# EAGLE design ecube EIB HS64 2xOmnetics r1 0.30mm (EAGLE 7.4.0)
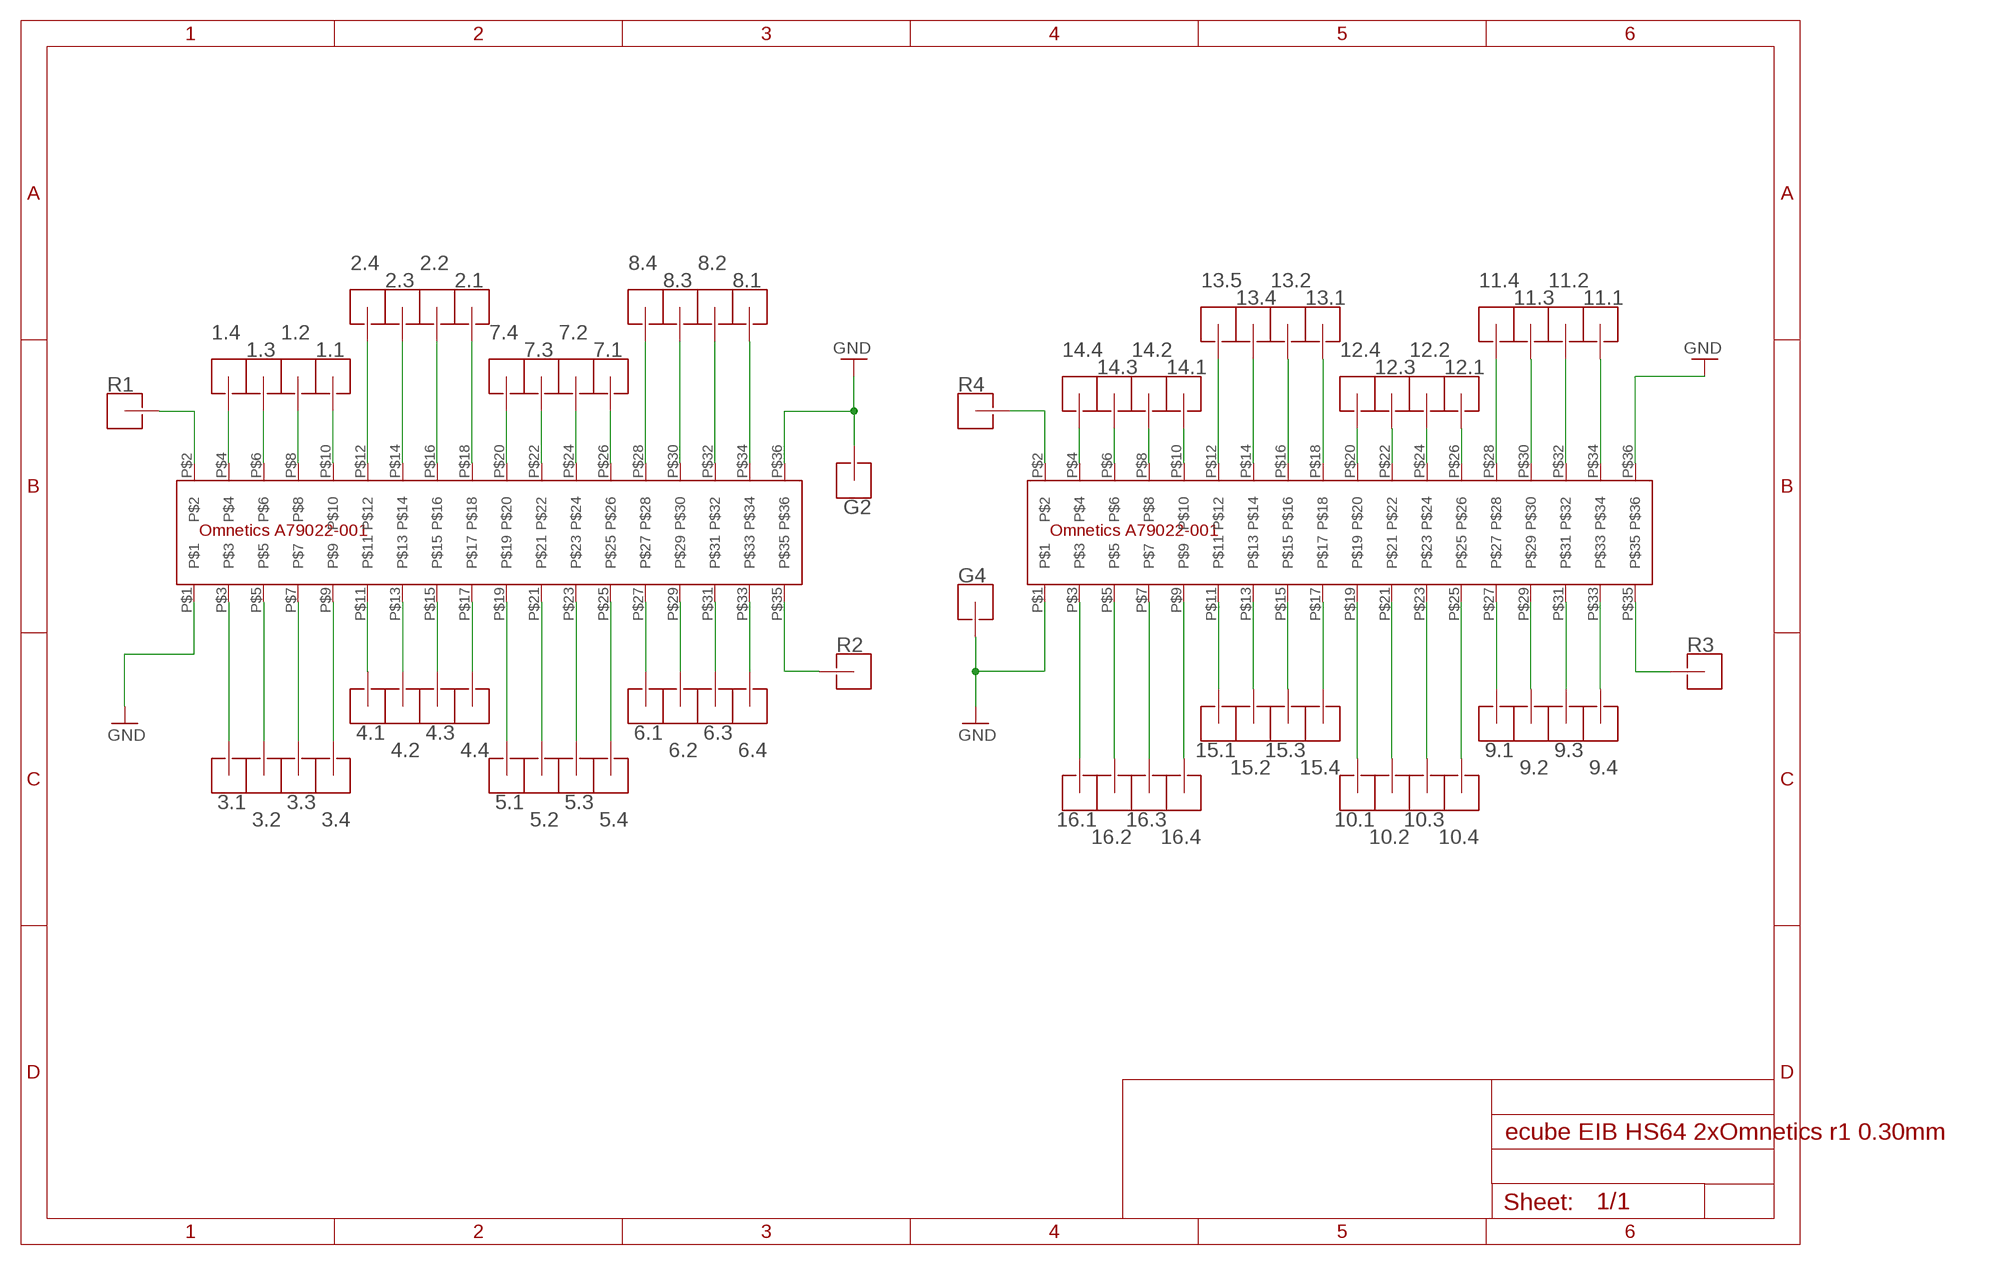
[diagram p0: schematic, sheet 1]

## Parts
1.1  HOLE_S_G_PIN_V3  [SMALL_GOLD_PIN_V3]
1.2  HOLE_S_G_PIN_V3  [SMALL_GOLD_PIN_V3]
1.3  HOLE_S_G_PIN_V3  [SMALL_GOLD_PIN_V3]
1.4  HOLE_S_G_PIN_V3  [SMALL_GOLD_PIN_V3]
2.1  HOLE_S_G_PIN_V3  [SMALL_GOLD_PIN_V3]
2.2  HOLE_S_G_PIN_V3  [SMALL_GOLD_PIN_V3]
2.3  HOLE_S_G_PIN_V3  [SMALL_GOLD_PIN_V3]
2.4  HOLE_S_G_PIN_V3  [SMALL_GOLD_PIN_V3]
3.1  HOLE_S_G_PIN_V3  [SMALL_GOLD_PIN_V3]
3.2  HOLE_S_G_PIN_V3  [SMALL_GOLD_PIN_V3]
3.3  HOLE_S_G_PIN_V3  [SMALL_GOLD_PIN_V3]
3.4  HOLE_S_G_PIN_V3  [SMALL_GOLD_PIN_V3]
4.1  HOLE_S_G_PIN_V3  [SMALL_GOLD_PIN_V3]
4.2  HOLE_S_G_PIN_V3  [SMALL_GOLD_PIN_V3]
4.3  HOLE_S_G_PIN_V3  [SMALL_GOLD_PIN_V3]
4.4  HOLE_S_G_PIN_V3  [SMALL_GOLD_PIN_V3]
5.1  HOLE_S_G_PIN_V3  [SMALL_GOLD_PIN_V3]
5.2  HOLE_S_G_PIN_V3  [SMALL_GOLD_PIN_V3]
5.3  HOLE_S_G_PIN_V3  [SMALL_GOLD_PIN_V3]
5.4  HOLE_S_G_PIN_V3  [SMALL_GOLD_PIN_V3]
6.1  HOLE_S_G_PIN_V3  [SMALL_GOLD_PIN_V3]
6.2  HOLE_S_G_PIN_V3  [SMALL_GOLD_PIN_V3]
6.3  HOLE_S_G_PIN_V3  [SMALL_GOLD_PIN_V3]
6.4  HOLE_S_G_PIN_V3  [SMALL_GOLD_PIN_V3]
7.1  HOLE_S_G_PIN_V3  [SMALL_GOLD_PIN_V3]
7.2  HOLE_S_G_PIN_V3  [SMALL_GOLD_PIN_V3]
7.3  HOLE_S_G_PIN_V3  [SMALL_GOLD_PIN_V3]
7.4  HOLE_S_G_PIN_V3  [SMALL_GOLD_PIN_V3]
8.1  HOLE_S_G_PIN_V3  [SMALL_GOLD_PIN_V3]
8.2  HOLE_S_G_PIN_V3  [SMALL_GOLD_PIN_V3]
8.3  HOLE_S_G_PIN_V3  [SMALL_GOLD_PIN_V3]
8.4  HOLE_S_G_PIN_V3  [SMALL_GOLD_PIN_V3]
9.1  HOLE_S_G_PIN_V3  [SMALL_GOLD_PIN_V3]
9.2  HOLE_S_G_PIN_V3  [SMALL_GOLD_PIN_V3]
9.3  HOLE_S_G_PIN_V3  [SMALL_GOLD_PIN_V3]
9.4  HOLE_S_G_PIN_V3  [SMALL_GOLD_PIN_V3]
10.1  HOLE_S_G_PIN_V3  [SMALL_GOLD_PIN_V3]
10.2  HOLE_S_G_PIN_V3  [SMALL_GOLD_PIN_V3]
10.3  HOLE_S_G_PIN_V3  [SMALL_GOLD_PIN_V3]
10.4  HOLE_S_G_PIN_V3  [SMALL_GOLD_PIN_V3]
11.1  HOLE_S_G_PIN_V3  [SMALL_GOLD_PIN_V3]
11.2  HOLE_S_G_PIN_V3  [SMALL_GOLD_PIN_V3]
11.3  HOLE_S_G_PIN_V3  [SMALL_GOLD_PIN_V3]
11.4  HOLE_S_G_PIN_V3  [SMALL_GOLD_PIN_V3]
12.1  HOLE_S_G_PIN_V3  [SMALL_GOLD_PIN_V3]
12.2  HOLE_S_G_PIN_V3  [SMALL_GOLD_PIN_V3]
12.3  HOLE_S_G_PIN_V3  [SMALL_GOLD_PIN_V3]
12.4  HOLE_S_G_PIN_V3  [SMALL_GOLD_PIN_V3]
13.1  HOLE_S_G_PIN_V3  [SMALL_GOLD_PIN_V3]
13.2  HOLE_S_G_PIN_V3  [SMALL_GOLD_PIN_V3]
13.4  HOLE_S_G_PIN_V3  [SMALL_GOLD_PIN_V3]
13.5  HOLE_S_G_PIN_V3  [SMALL_GOLD_PIN_V3]
14.1  HOLE_S_G_PIN_V3  [SMALL_GOLD_PIN_V3]
14.2  HOLE_S_G_PIN_V3  [SMALL_GOLD_PIN_V3]
14.3  HOLE_S_G_PIN_V3  [SMALL_GOLD_PIN_V3]
14.4  HOLE_S_G_PIN_V3  [SMALL_GOLD_PIN_V3]
15.1  HOLE_S_G_PIN_V3  [SMALL_GOLD_PIN_V3]
15.2  HOLE_S_G_PIN_V3  [SMALL_GOLD_PIN_V3]
15.3  HOLE_S_G_PIN_V3  [SMALL_GOLD_PIN_V3]
15.4  HOLE_S_G_PIN_V3  [SMALL_GOLD_PIN_V3]
16.1  HOLE_S_G_PIN_V3  [SMALL_GOLD_PIN_V3]
16.2  HOLE_S_G_PIN_V3  [SMALL_GOLD_PIN_V3]
16.3  HOLE_S_G_PIN_V3  [SMALL_GOLD_PIN_V3]
16.4  HOLE_S_G_PIN_V3  [SMALL_GOLD_PIN_V3]
G2  HOLE_L_G_PIN_V1  [LARGE_GOLD_PIN_V1]
G4  HOLE_L_G_PIN_V1  [LARGE_GOLD_PIN_V1]
R1  HOLE_L_G_PIN_V1  [LARGE_GOLD_PIN_V1]
R2  HOLE_L_G_PIN_V1  [LARGE_GOLD_PIN_V1]
R3  HOLE_L_G_PIN_V1  [LARGE_GOLD_PIN_V1]
R4  HOLE_L_G_PIN_V1  [LARGE_GOLD_PIN_V1]
U$1  A79022-001  [A79022-001]
U$2  A79022-001  [A79022-001]

## Nets
GND: G2.P$1 G4.P$1 U$1.P$1 U$1.P$36 U$2.P$1 U$2.P$36
N$1: R4.P$1 U$2.P$2
N$2: R2.P$1 U$1.P$35
N$3: R1.P$1 U$1.P$2
N$4: 14.4.P$1 U$2.P$4
N$5: 14.3.P$1 U$2.P$6
N$6: 14.2.P$1 U$2.P$8
N$7: 14.1.P$1 U$2.P$10
N$8: 13.5.P$1 U$2.P$12
N$9: 13.4.P$1 U$2.P$14
N$10: 13.2.P$1 U$2.P$16
N$11: 13.1.P$1 U$2.P$18
N$12: 12.4.P$1 U$2.P$20
N$13: 12.3.P$1 U$2.P$22
N$14: 12.2.P$1 U$2.P$24
N$15: 12.1.P$1 U$2.P$26
N$16: 11.4.P$1 U$2.P$28
N$17: 11.3.P$1 U$2.P$30
N$18: 11.2.P$1 U$2.P$32
N$19: 11.1.P$1 U$2.P$34
N$20: 9.4.P$1 U$2.P$33
N$21: 9.3.P$1 U$2.P$31
N$22: R3.P$1 U$2.P$35
N$23: 9.2.P$1 U$2.P$29
N$24: 9.1.P$1 U$2.P$27
N$25: 10.4.P$1 U$2.P$25
N$26: 10.3.P$1 U$2.P$23
N$27: 10.2.P$1 U$2.P$21
N$28: 10.1.P$1 U$2.P$19
N$29: 15.4.P$1 U$2.P$17
N$30: 15.3.P$1 U$2.P$15
N$31: 15.2.P$1 U$2.P$13
N$32: 15.1.P$1 U$2.P$11
N$33: 3.1.P$1 U$1.P$3
N$34: 16.4.P$1 U$2.P$9
N$35: 16.3.P$1 U$2.P$7
N$36: 3.2.P$1 U$1.P$5
N$37: 3.3.P$1 U$1.P$7
N$38: 3.4.P$1 U$1.P$9
N$39: 4.1.P$1 U$1.P$11
N$40: 4.2.P$1 U$1.P$13
N$41: 4.3.P$1 U$1.P$15
N$42: 4.4.P$1 U$1.P$17
N$43: 5.1.P$1 U$1.P$19
N$44: 5.2.P$1 U$1.P$21
N$45: 5.3.P$1 U$1.P$23
N$46: 5.4.P$1 U$1.P$25
N$47: 6.1.P$1 U$1.P$27
N$48: 6.2.P$1 U$1.P$29
N$49: 6.3.P$1 U$1.P$31
N$50: 6.4.P$1 U$1.P$33
N$51: 16.2.P$1 U$2.P$5
N$52: 16.1.P$1 U$2.P$3
N$53: 8.1.P$1 U$1.P$34
N$54: 8.2.P$1 U$1.P$32
N$55: 8.3.P$1 U$1.P$30
N$56: 8.4.P$1 U$1.P$28
N$57: 7.1.P$1 U$1.P$26
N$58: 7.2.P$1 U$1.P$24
N$59: 7.3.P$1 U$1.P$22
N$60: 7.4.P$1 U$1.P$20
N$61: 2.1.P$1 U$1.P$18
N$62: 2.2.P$1 U$1.P$16
N$63: 2.3.P$1 U$1.P$14
N$64: 2.4.P$1 U$1.P$12
N$65: 1.1.P$1 U$1.P$10
N$66: 1.2.P$1 U$1.P$8
N$67: 1.3.P$1 U$1.P$6
N$68: 1.4.P$1 U$1.P$4

## Library data of the parts
1.1-1.4 2.1-2.4 3.1-3.4 4.1-4.4 5.1-5.4 6.1-6.4 7.1-7.4 8.1-8.4 9.1-9.4 10.1-10.4 11.1-11.4 12.1-12.4 13.1 13.2 13.4 13.5 14.1-14.4 15.1-15.4 16.1-16.4 G2 G4 R1-R4 = pin and holes:HOLE
U$1 U$2 = ZIF-13:A79022-001

## Board
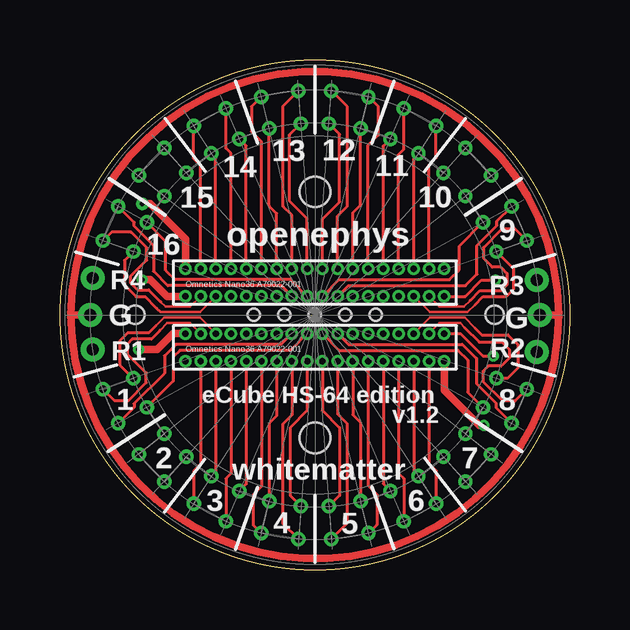
[diagram p1: board, top side]
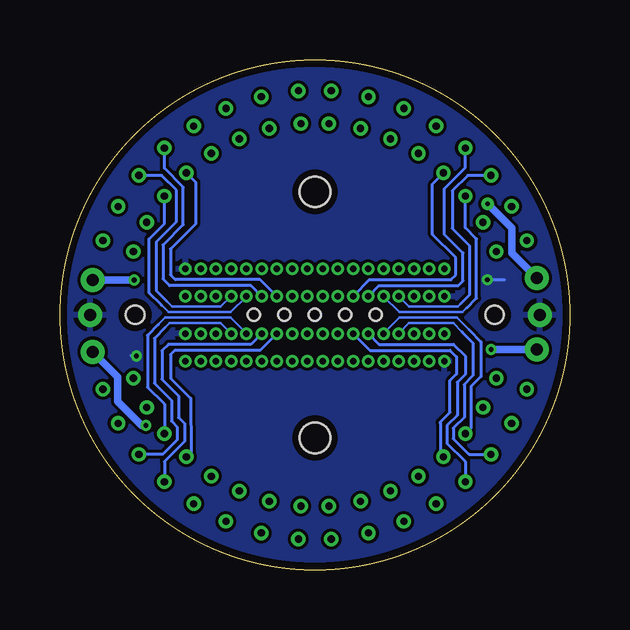
[diagram p2: board, bottom side, seen from below]

Size 21.26 x 21.26 mm. Coordinates in mm from the lower left corner, seen from the top.
Outline: circle at 10.63,10.63 radius 10.63
Copper layers (1*16): Top 0.035mm / dielectric 1.5mm / Bottom 0.035mm
Design rules "PCB-POOL HighSpec *": minimum track width 4.5mil, minimum drill 0.2mm, track to track 0.125mm, track to pad 0.125mm, pad to pad 0.125mm, via to via 0.125mm, smd to smd 0.125mm, copper to edge 0.3mm, drill to drill 0.2mm, minimum pad ring 0.125mm, minimum via ring 0.125mm, stop-mask expansion 0.005mm, vias tented up to drill 0.2mm, thermal gap 0.2mm
Holes 0.5 mm at 10.63,10.63 8.09,10.63 13.17,10.63 9.36,10.63 11.9,10.63
Holes 0.76 mm at 3.14,10.63 18.12,10.63
Holes 1.27 mm at 10.63,15.76 10.63,5.5

### Footprints (pad centres in the part's own frame; a part is rotated, then mirrored left to right if it is on the bottom)
SMALL_GOLD_PIN_V3 = drill 0.3 pad 0.6: P$1 0,0
LARGE_GOLD_PIN_V1 = drill 0.5 pad 1: P$1 0,0
A79022-001 = drill 0.267 pad 0.521: P$1 0,-1.143; P$2 0,0; P$3 0.635,-1.143; P$4 0.635,0; P$5 1.27,-1.143; P$6 1.27,0; P$7 1.905,-1.143; P$8 1.905,0; P$9 2.54,-1.143; P$10 2.54,0; P$11 3.175,-1.143; P$12 3.175,0; P$13 3.81,-1.143; P$14 3.81,0; P$15 4.445,-1.143; P$16 4.445,0; P$17 5.08,-1.143; P$18 5.08,0; P$19 5.715,-1.143; P$20 5.715,0; P$21 6.35,-1.143; P$22 6.35,0; P$23 6.985,-1.143; P$24 6.985,0; P$25 7.62,-1.143; P$26 7.62,0; P$27 8.255,-1.143; P$28 8.255,0; P$29 8.89,-1.143; P$30 8.89,0; P$31 9.525,-1.143; P$32 9.525,0; P$33 10.16,-1.143; P$34 10.16,0; P$35 10.795,-1.143; P$36 10.795,0

### Placement (x,y rotation side)
1.1  4.36,5.68 0 top
1.2  3.29,4.81 0 top
1.3  3.06,7.99 0 top
1.4  1.79,7.53 0 top
2.1  3.62,6.77 0 top
2.2  2.43,6.11 0 top
2.3  5.27,4.71 0 top
2.4  4.36,3.67 0 top
3.1  5.58,2.76 0 top
3.2  6.31,3.9 0 top
3.3  6.92,2.02 0 top
3.4  7.48,3.29 0 top
4.1  8.4,1.54 0 top
4.2  8.73,2.86 0 top
4.3  9.94,1.28 0 top
4.4  10.05,2.65 0 top
5.1  11.21,2.65 0 top
5.2  11.32,1.28 0 top
5.3  12.54,2.86 0 top
5.4  12.87,1.54 0 top
6.1  13.78,3.29 0 top
6.2  14.34,2.02 0 top
6.3  14.95,3.9 0 top
6.4  15.69,2.76 0 top
7.1  16.9,3.67 0 top
7.2  15.99,4.71 0 top
7.3  18.83,6.11 0 top
7.4  17.64,6.77 0 top
8.1  19.47,7.53 0 top
8.2  18.2,7.99 0 top
8.3  17.97,4.81 0 top
8.4  16.9,5.68 0 top
9.1  16.9,15.58 0 top
9.2  17.97,16.45 0 top
9.3  18.2,13.27 0 top
9.4  19.47,13.73 0 top
10.1  17.64,14.49 0 top
10.2  18.83,15.15 0 top
10.3  15.99,16.55 0 top
10.4  16.9,17.59 0 top
11.1  15.69,18.5 0 top
11.2  14.95,17.36 0 top
11.3  14.34,19.24 0 top
11.4  13.78,17.97 0 top
12.1  12.87,19.72 0 top
12.2  12.54,18.4 0 top
12.3  11.32,19.98 0 top
12.4  11.21,18.61 0 top
13.1  10.05,18.61 0 top
13.2  9.94,19.98 0 top
13.4  8.73,18.4 0 top
13.5  8.4,19.72 0 top
14.1  7.48,17.97 0 top
14.2  6.92,19.24 0 top
14.3  6.31,17.36 0 top
14.4  5.58,18.5 0 top
15.1  4.36,17.59 0 top
15.2  5.27,16.55 0 top
15.3  2.43,15.15 0 top
15.4  3.62,14.49 0 top
16.1  1.79,13.73 0 top
16.2  3.06,13.27 0 top
16.3  3.29,16.45 0 top
16.4  4.36,15.58 0 top
G2  20,10.63 0 top
G4  1.26,10.63 0 top
R1  1.37,9.18 0 top
R2  19.89,9.09 0 top
R3  19.89,12.08 0 top
R4  1.37,12.17 0 top
U$1  5.23,9.85 0 top
U$2  5.23,12.55 0 top

### Tracks (layer width: path | path; a pad name or v marks a point on that pad's centre or on a via)
GND  (via drill 0.2 pad 0.45)
  Top 0.125: U$1.P$36 16.7,9.85 17.63,8.92 v18.07,8.92
  Top 0.305: 20.79,10.63 arc-87 11.14,0.47 arc-93 0.46,10.63 | G4.P$1 0.46,10.63 arc-180 20.79,10.63 | v3.43,12.1 3.77,12.1 4.46,11.41 U$2.P$1 | G2.P$1 20.03,10.63 20.79,10.63
  Bottom 0.125: v18.07,8.92 18.3,8.92 | v3.43,12.1 2.72,12.1
  pour Bottom (isolate 0.127): 10.66,21.28 10.72,21.28 arc-90 21.36,10.64 21.36,10.6 arc-90 10.66,-0.1 10.64,-0.1 arc-90 0,10.54 0,10.55 arc-90 10.76,21.31
N$1  (via drill 0.2 pad 0.52)
  Top 0.305: U$2.P$2 5.23,13.8 3.76,15.26 v3.43,15.26
  Bottom 0.125: v3.43,15.26 3.42,15.25
  Bottom 0.305: 3.42,15.25 2.43,14.24 2.43,13.22 R4.P$1
N$2  (via drill 0.2 pad 0.45)
  Top 0.305: U$1.P$35 16.02,7.48 17.48,6.02 v17.68,6.02
  Bottom 0.305: R2.P$1 18.85,8.05 18.85,7.02 17.85,6.02 v17.68,6.02
N$3  (via drill 0.2 pad 0.45)
  Top 0.305: U$1.P$2 4.71,9.85 4.05,9.19 v3.28,9.19
  Bottom 0.125: R1.P$1
  Bottom 0.305: v3.28,9.19 R1.P$1
N$4
  Top 0.125: U$2.P$4 5.86,16.86 5.58,17.14 14.4.P$1
N$5
  Top 0.125: U$2.P$6 6.5,17.18 14.3.P$1
N$6
  Top 0.125: U$2.P$8 7.13,17.37 6.92,17.58 14.2.P$1
N$7
  Top 0.125: U$2.P$10 7.77,17.68 14.1.P$1
N$8
  Top 0.125: U$2.P$12 8.4,17.86 7.99,18.28 7.99,19.32 13.5.P$1
N$9
  Top 0.125: U$2.P$14 9.04,14.86 8.73,15.18 13.4.P$1
N$10
  Top 0.125: U$2.P$16 9.67,14.78 9.31,15.15 9.31,19.34 13.2.P$1
N$11
  Top 0.125: U$2.P$18 10.31,14.64 9.58,15.37 9.58,18.14 13.1.P$1
N$12
  Top 0.125: U$2.P$20 10.94,14.62 11.66,15.34 11.66,18.16 12.4.P$1
N$13
  Top 0.125: U$2.P$22 11.58,14.76 11.99,15.17 11.99,19.31 12.3.P$1
N$14
  Top 0.125: U$2.P$24 12.21,14.89 12.54,15.21 12.2.P$1
N$15
  Top 0.125: U$2.P$26 12.85,17.71 13.26,18.12 13.26,19.33 12.1.P$1
N$16
  Top 0.125: U$2.P$28 13.48,17.68 11.4.P$1
N$17
  Top 0.125: U$2.P$30 14.12,17.32 14.34,17.54 11.3.P$1
N$18
  Top 0.125: U$2.P$32 14.75,17.14 14.95,17.33 11.2.P$1
N$19
  Top 0.125: U$2.P$34 15.39,16.88 15.68,17.18 11.1.P$1
N$20
  Top 0.114: U$2.P$33 15.83,10.97 16.85,10.97 17.11,11.23
  Top 0.125: 9.4.P$1 18.97,14.23 18.45,14.23 17.67,13.45 17.67,12.98 18.03,12.62 18.38,12.62 18.64,12.36 18.64,11.88 18.4,11.64 17.52,11.64 17.11,11.23
N$21
  Top 0.114: U$2.P$31 15.42,10.74 17,10.74 17.3,11.05
  Top 0.125: 9.3.P$1 18.93,12.54 18.93,11.71 18.61,11.39 17.64,11.39 17.3,11.05
N$22  (via drill 0.2 pad 0.45)
  Top 0.125: U$2.P$35 16.9,11.41 17.57,12.08 v18.17,12.08
  Bottom 0.125: v18.17,12.08
  Bottom 0.305: v18.17,12.08 R3.P$1
N$23
  Bottom 0.114: U$2.P$29 14.56,10.97 16.58,10.97 16.8,11.19
  Bottom 0.125: 9.2.P$1 17.02,16.45 16.4,15.83 16.4,14.52 17.24,13.68 17.24,11.63 16.8,11.19
N$24
  Bottom 0.114: U$2.P$27 14.15,10.74 16.74,10.74 17.03,11.03
  Bottom 0.125: 9.1.P$1 16.9,14.44 17.55,13.8 17.55,11.55 17.03,11.03
N$25
  Bottom 0.125: 10.4.P$1 16.9,16.74 16.12,15.96 16.12,14.39 16.97,13.55 16.97,12.13 16.69,11.85 13.29,11.85 U$2.P$25
N$26
  Bottom 0.125: 10.3.P$1 15.59,16.15 15.59,14.44 16.65,13.38 16.65,12.3 16.45,12.1 12.91,12.1 U$2.P$23
N$27
  Top 0.125: 10.2.P$1 18.22,14.54 18.22,14.36 17.39,13.53 17.39,12.33 16.91,11.85 12.02,11.85 U$2.P$21
N$28
  Top 0.125: U$2.P$19 11.64,12.1 16.24,12.1 16.65,12.5 16.65,13.5 10.1.P$1
N$29
  Top 0.125: 15.4.P$1 4.41,13.7 4.41,12.49 4.8,12.1 9.61,12.1 U$2.P$17
N$30
  Top 0.125: 15.3.P$1 3.09,14.48 3.09,14.33 3.9,13.52 3.9,12.45 4.5,11.85 9.23,11.85 U$2.P$15
N$31
  Bottom 0.125: 15.2.P$1 5.73,16.09 5.73,13.99 4.75,13.01 4.75,12.3 4.95,12.1 8.34,12.1 U$2.P$13
N$32
  Bottom 0.125: 15.1.P$1 4.36,16.77 5.23,15.89 5.23,13.99 4.46,13.21 4.46,12.04 4.65,11.85 7.96,11.85 U$2.P$11
N$33
  Top 0.125: U$1.P$3 5.86,4.41 5.58,4.12 3.1.P$1
N$34
  Bottom 0.114: U$2.P$9 7.1,10.74 4.48,10.74 4.3,10.92
  Bottom 0.125: 16.4.P$1 4.36,14.26 3.89,13.8 3.89,11.33 4.3,10.92
N$35
  Bottom 0.114: U$2.P$7 6.7,10.97 4.67,10.97 4.55,11.1 | 4.55,11.1
  Bottom 0.125: 16.3.P$1 4.26,16.45 4.9,15.81 4.9,14.23 4.17,13.51 4.17,11.47 4.55,11.1
N$36
  Top 0.125: U$1.P$5 6.5,4.1 6.31,3.91 3.2.P$1
N$37
  Top 0.125: U$1.P$7 7.13,4.02 6.92,3.81 3.3.P$1
N$38
  Top 0.125: U$1.P$9 7.77,3.58 3.4.P$1
N$39
  Top 0.125: U$1.P$11 8.4,3.48 8.06,3.13 8.06,1.88 4.1.P$1
N$40
  Top 0.125: U$1.P$13 9.04,6.43 8.73,6.11 4.2.P$1
N$41
  Top 0.125: U$1.P$15 9.67,6.45 9.29,6.06 9.29,1.94 4.3.P$1
N$42
  Top 0.125: U$1.P$17 10.31,6.64 9.6,5.93 9.6,3.1 4.4.P$1
N$43
  Top 0.125: U$1.P$19 10.94,6.64 11.66,5.93 11.66,3.1 5.1.P$1
N$44
  Top 0.125: U$1.P$21 11.58,6.49 11.96,6.11 11.96,1.93 5.2.P$1
N$45
  Top 0.125: U$1.P$23 12.21,6.47 12.54,6.15 5.3.P$1
N$46
  Top 0.125: U$1.P$25 12.85,3.51 13.21,3.15 13.21,1.88 5.4.P$1
N$47
  Top 0.125: U$1.P$27 13.48,3.58 6.1.P$1
N$48
  Top 0.125: U$1.P$29 14.12,4.02 14.34,3.8 6.2.P$1
N$49
  Top 0.125: U$1.P$31 14.75,4.07 14.95,3.88 6.3.P$1
N$50
  Top 0.125: U$1.P$33 15.39,4.44 15.68,4.14 6.4.P$1
N$51
  Top 0.114: U$2.P$5 5.83,10.74 4.2,10.74 4.03,10.91 | 4.03,10.91
  Top 0.125: 16.2.P$1 2.69,12.9 2.69,11.87 3.18,11.39 3.54,11.39 | 4.03,10.91 3.54,11.39 | 3.54,11.39
N$52
  Top 0.114: U$2.P$3 5.43,10.97 4.41,10.97 4.21,11.17 4.2,11.17
  Top 0.125: 16.1.P$1 2.15,14.08 2.97,14.08 3.62,13.43 3.62,12.92 2.96,12.25 2.96,11.97 3.25,11.68 3.7,11.68 4.2,11.17
N$53
  Top 0.114: U$1.P$34 15.82,10.28 16.69,10.28 16.87,10.1
  Top 0.125: 8.1.P$1 18.97,7.03 18.46,7.03 17.66,7.83 17.66,8.29 17.86,8.49 18.4,8.49 18.73,8.82 18.73,9.19 18.43,9.49 17.48,9.49 16.87,10.1
N$54
  Top 0.114: U$1.P$32 15.42,10.51 16.88,10.51 17.31,10.08
  Top 0.125: 8.2.P$1 18.67,7.99 19.09,8.41 19.09,9.4 18.69,9.8 17.59,9.8 17.31,10.08
N$55
  Bottom 0.114: U$1.P$30 14.55,10.28 16.69,10.28 16.88,10.1
  Bottom 0.125: 8.3.P$1 16.98,4.81 16.38,5.41 16.38,5.97 16.61,6.2 16.61,7.07 17.32,7.78 17.32,9.65 16.88,10.1
N$56
  Bottom 0.114: U$1.P$28 14.15,10.51 16.88,10.51 17.16,10.23
  Bottom 0.125: 8.4.P$1 16.9,6.91 17.61,7.61 17.61,9.78 17.16,10.23
N$57
  Bottom 0.125: 7.1.P$1 16.9,4.51 16.06,5.36 16.06,6.09 16.32,6.35 16.32,7.25 17,7.94 17,9.14 16.74,9.4 13.3,9.4 U$1.P$26
N$58
  Bottom 0.125: 7.2.P$1 15.8,4.9 15.8,7.15 16.64,7.99 16.65,8.98 16.47,9.15 12.91,9.15 U$1.P$24
N$59
  Top 0.125: 18.18,6.76 18.18,6.95 17.37,7.77 17.37,8.82 16.78,9.4 12.03,9.4 U$1.P$22 | 18.18,6.76 | 18.18,6.76 7.3.P$1
N$60
  Top 0.125: 7.4.P$1 17.01,7.4 17.01,8.74 16.6,9.15 11.64,9.15 U$1.P$20
N$61
  Top 0.125: 2.1.P$1 4.72,7.87 4.72,8.87 5,9.15 9.63,9.15 9.63,9.17 U$1.P$18
N$62
  Top 0.125: 2.2.P$1 3.09,6.77 3.09,6.93 4.36,8.2 4.36,8.92 4.84,9.4 9.23,9.4 U$1.P$16
N$63
  Bottom 0.125: 2.3.P$1 5.4,4.86 5.4,6.12 5.4,6.17 5,6.57 5,7.89 4.73,8.16 4.73,8.88 5,9.15 8.34,9.15 U$1.P$14
N$64
  Bottom 0.125: 2.4.P$1 4.36,4.51 5.12,5.28 5.12,6.02 4.69,6.45 4.69,7.82 4.35,8.15 4.35,8.91 4.84,9.4 7.96,9.4 U$1.P$12
N$65
  Bottom 0.114: U$1.P$10 7.11,10.51 4.71,10.51 4.2,10
  Bottom 0.125: 1.1.P$1 4.12,5.91 4.12,7.64 3.71,8.06 3.71,9.51 4.2,10
N$66
  Bottom 0.114: U$1.P$8 6.7,10.28 4.86,10.28 4.5,9.92
  Bottom 0.125: 1.2.P$1 4.21,4.81 4.85,5.46 4.85,5.91 4.4,6.34 4.4,7.72 4.05,8.1 4.05,9.47 4.5,9.92
N$67
  Top 0.114: U$1.P$6 5.84,10.51 4.33,10.51 3.99,10.17
  Top 0.125: 1.3.P$1 2.5,8.55 2.5,9.55 2.83,9.88 3.7,9.88 3.99,10.17
N$68
  Top 0.114: U$1.P$4 5.43,10.28 4.48,10.28 4.17,9.98
  Top 0.125: 1.4.P$1 2.27,7.05 2.84,7.05 3.59,7.8 3.59,8.21 2.8,9.01 2.8,9.4 3.02,9.62 3.81,9.62 4.17,9.98

### Text on the board
tPlace: 13 | 12 | 14 | 11 | 15 | 10 | openephys | 9 | 16 | R4 | R3 | G | G | R1 | R2 | 1 | eCube HS-64 edition | 8 | v1.2 | 2 | whitematter | 7 | 3 | 4 | 6 | 5